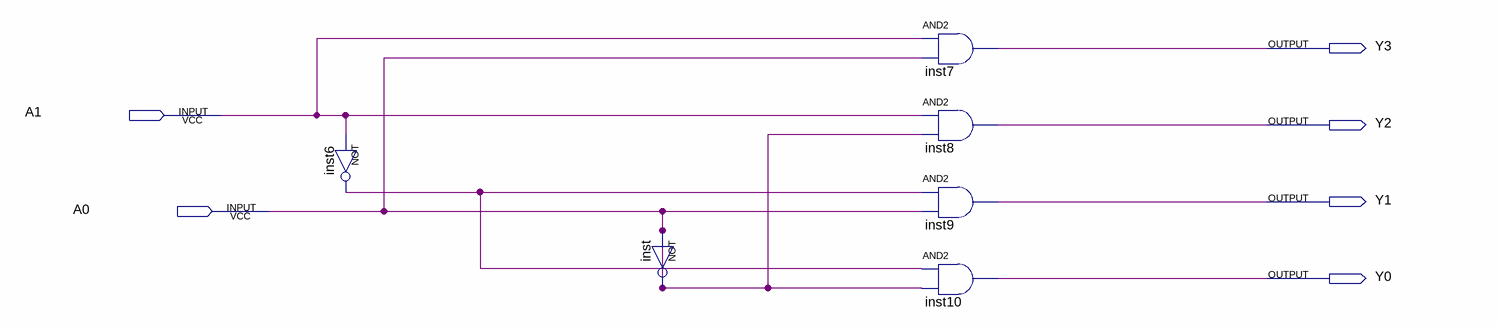
[diagram p0: schematic sheet]
// Quartus schematic Decoder.bdf as structural Verilog: 6 symbols, 6 pins
module Decoder (
  input  A1,
  input  A0,
  output Y3,
  output Y2,
  output Y1,
  output Y0
);

  wire inst6_out;

  not inst6 (inst6_out, A1);
  not inst (A0, A0);
  and inst7 (Y3, A1, A0);
  and inst8 (Y2, A1, A0);
  and inst9 (Y1, inst6_out, A0);
  and inst10 (Y0, inst6_out, A0);
endmodule
